# EAGLE design smile1 (EAGLE 5.05)
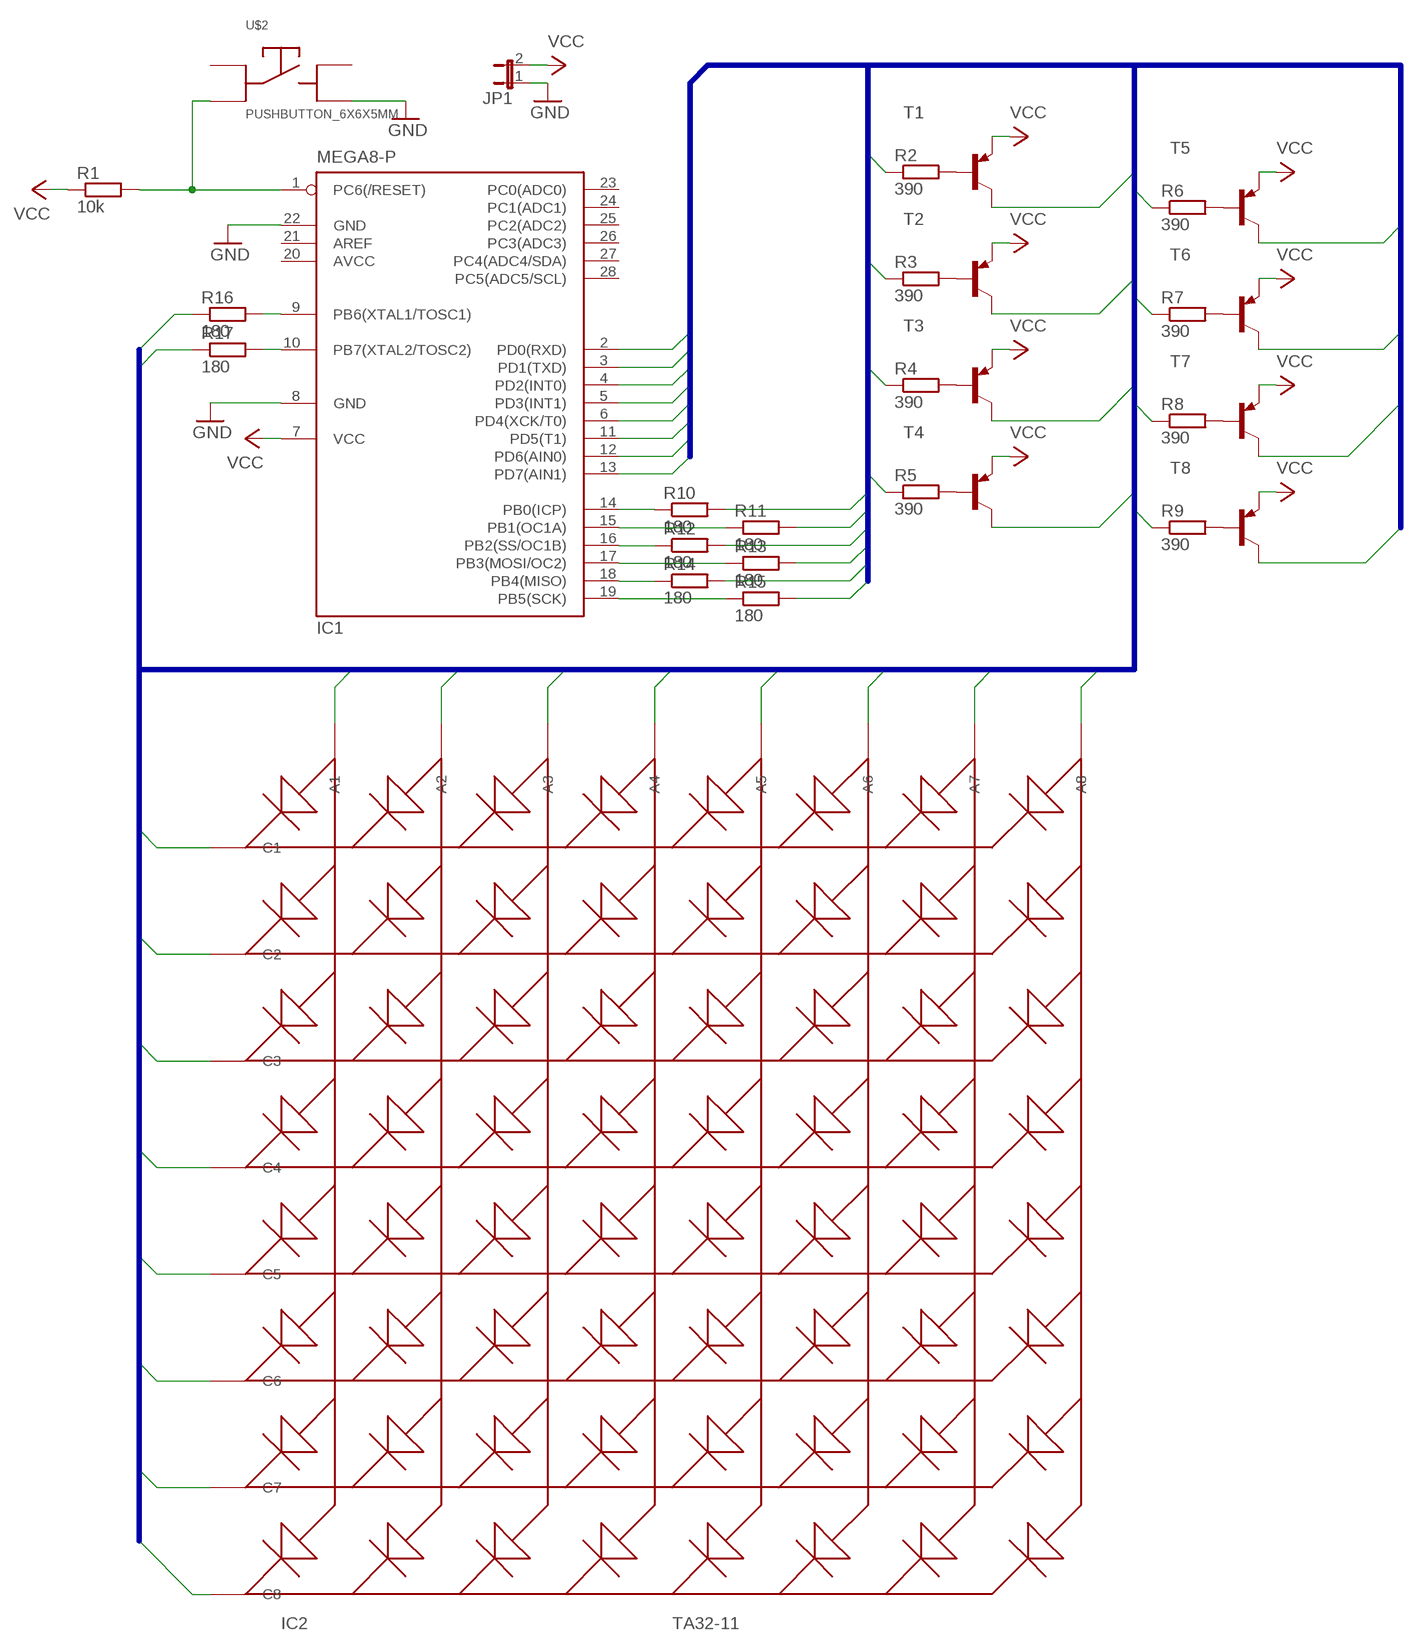
[diagram p0: schematic, sheet 1]

## Parts
IC1  MEGA8-P  [DIL28-3]
IC2  TA32-11  [TA23-11]
JP1  JP1E  [JP1]
R1  10k  R-EU_R0805  [R0805]
R2  390  R-EU_R0805  [R0805]
R3  390  R-EU_R0805  [R0805]
R4  390  R-EU_R0805  [R0805]
R5  390  R-EU_R0805  [R0805]
R6  390  R-EU_R0805  [R0805]
R7  390  R-EU_R0805  [R0805]
R8  390  R-EU_R0805  [R0805]
R9  390  R-EU_R0805  [R0805]
R10  180  R-EU_R0805  [R0805]
R11  180  R-EU_R0805  [R0805]
R12  180  R-EU_R0805  [R0805]
R13  180  R-EU_R0805  [R0805]
R14  180  R-EU_R0805  [R0805]
R15  180  R-EU_R0805  [R0805]
R16  180  R-EU_R0805  [R0805]
R17  180  R-EU_R0805  [R0805]
T1  BC807-16-PNP-SOT23-BEC  [SOT23-BEC]
T2  BC807-16-PNP-SOT23-BEC  [SOT23-BEC]
T3  BC807-16-PNP-SOT23-BEC  [SOT23-BEC]
T4  BC807-16-PNP-SOT23-BEC  [SOT23-BEC]
T5  BC807-16-PNP-SOT23-BEC  [SOT23-BEC]
T6  BC807-16-PNP-SOT23-BEC  [SOT23-BEC]
T7  BC807-16-PNP-SOT23-BEC  [SOT23-BEC]
T8  BC807-16-PNP-SOT23-BEC  [SOT23-BEC]
U$2  PUSHBUTTON_6X6X5MM  [TACT_6X6X5MM]

## Nets
A0: IC2.P$13(A1) T1.C
A1: IC2.P$3(A2) T2.C
A2: IC2.P$4(A3) T3.C
A3: IC2.P$10(A4) T4.C
A4: IC2.P$6(A5) T5.C
A5: IC2.P$11(A6) T6.C
A6: IC2.P$15(A7) T7.C
A7: IC2.P$16(A8) T8.C
C0: IC1.2(PD0(RXD)) R2.1
C1: IC1.3(PD1(TXD)) R3.1
C2: IC1.4(PD2(INT0)) R4.1
C3: IC1.5(PD3(INT1)) R5.1
C4: IC1.6(PD4(XCK/T0)) R6.1
C5: IC1.11(PD5(T1)) R7.1
C6: IC1.12(PD6(AIN0)) R8.1
C7: IC1.13(PD7(AIN1)) R9.1
GND: IC1.8(GND) IC1.22(GND) JP1.1 U$2.PIN2.2
N$1: IC1.1(PC6(/RESET)) R1.2 U$2.PIN1.2
N$2: R2.2 T1.B
N$3: R3.2 T2.B
N$4: R4.2 T3.B
N$5: R5.2 T4.B
N$6: R6.2 T5.B
N$7: R7.2 T6.B
N$8: R8.2 T7.B
N$9: R9.2 T8.B
N$10: IC1.14(PB0(ICP)) R10.1
N$11: IC1.15(PB1(OC1A)) R11.1
N$12: IC1.16(PB2(SS/OC1B)) R12.1
N$13: IC1.17(PB3(MOSI/OC2)) R13.1
N$14: IC1.18(PB4(MISO)) R14.1
N$15: IC1.19(PB5(SCK)) R15.1
N$16: IC1.9(PB6(XTAL1/TOSC1)) R16.2
N$17: IC1.10(PB7(XTAL2/TOSC2)) R17.2
R0: IC2.P$9(C1) R10.2
R1: IC2.P$14(C2) R11.2
R2: IC2.P$8(C3) R12.2
R3: IC2.P$12(C4) R13.2
R4: IC2.P$1(C5) R14.2
R5: IC2.P$7(C6) R15.2
R6: IC2.P$2(C7) R16.1
R7: IC2.P$5(C8) R17.1
VCC: IC1.7(VCC) JP1.2 R1.1 T1.E T2.E T3.E T4.E T5.E T6.E T7.E T8.E
Unconnected: IC1.21(AREF) IC1.23(PC0(ADC0)) IC1.24(PC1(ADC1)) IC1.25(PC2(ADC2)) IC1.26(PC3(ADC3)) IC1.27(PC4(ADC4/SDA)) IC1.28(PC5(ADC5/SCL)) U$2.PIN1.1 U$2.PIN2.1(PIN2,1)

## Buses
BUS1:C[0..7],PWR[0..7],R[0..7],A[0..7]

## Power pins joined to a net without a drawn wire
AVCC: IC1.20(AVCC)

## Library data of the parts
IC1 = atmel:MEGA8-P: MICROCONTROLLER 8 Kbytes FLASH, 1 kbytes SRAM, 512 bytes EEPROM, USART, 4-channel 10 bit ADC, 2-channel 8 bit ADC Pin compatible with Atmega48, ATMega88, ATMega168 Source: avr.lbr
IC2 = kingbright:TA32-11: TA23-11 Kingbright 8x8 LAD Matrix
JP1 = jumper:JP1E: JUMPER
R1-R17 = rcl:R-EU_: RESISTOR, European symbol
T1-T8 = transistor:*-PNP-: PNP Transistror
U$2 = button:PUSHBUTTON_6X6X5MM: PushButton 6x6x5mm

## Board
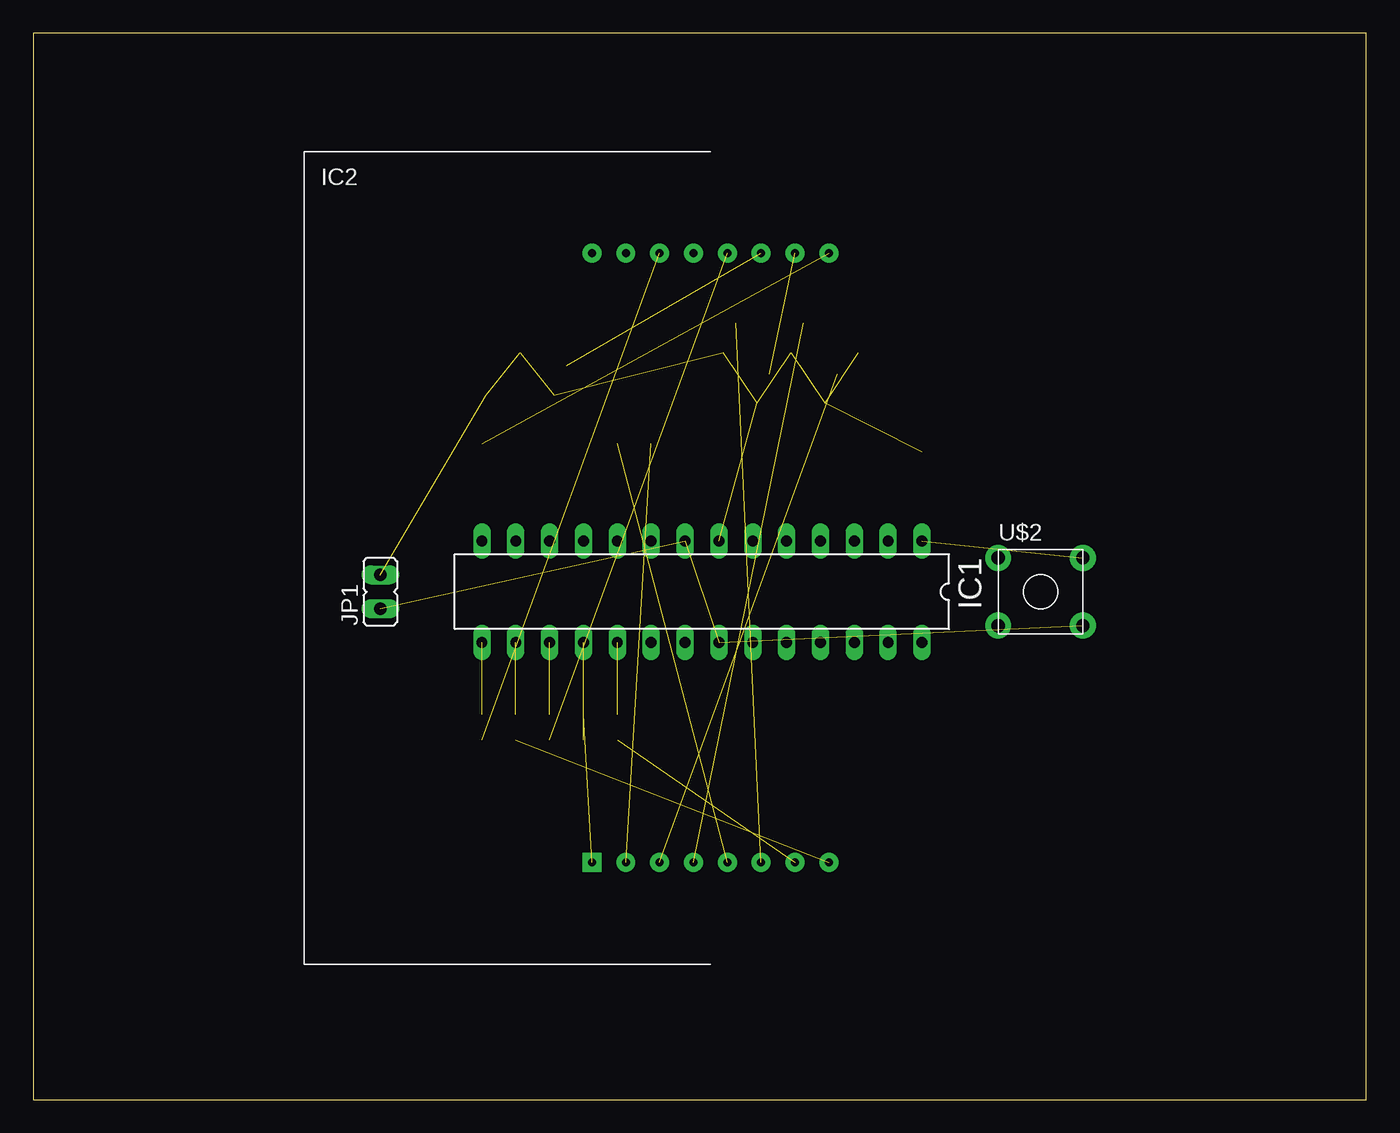
[diagram p1: board, top side]
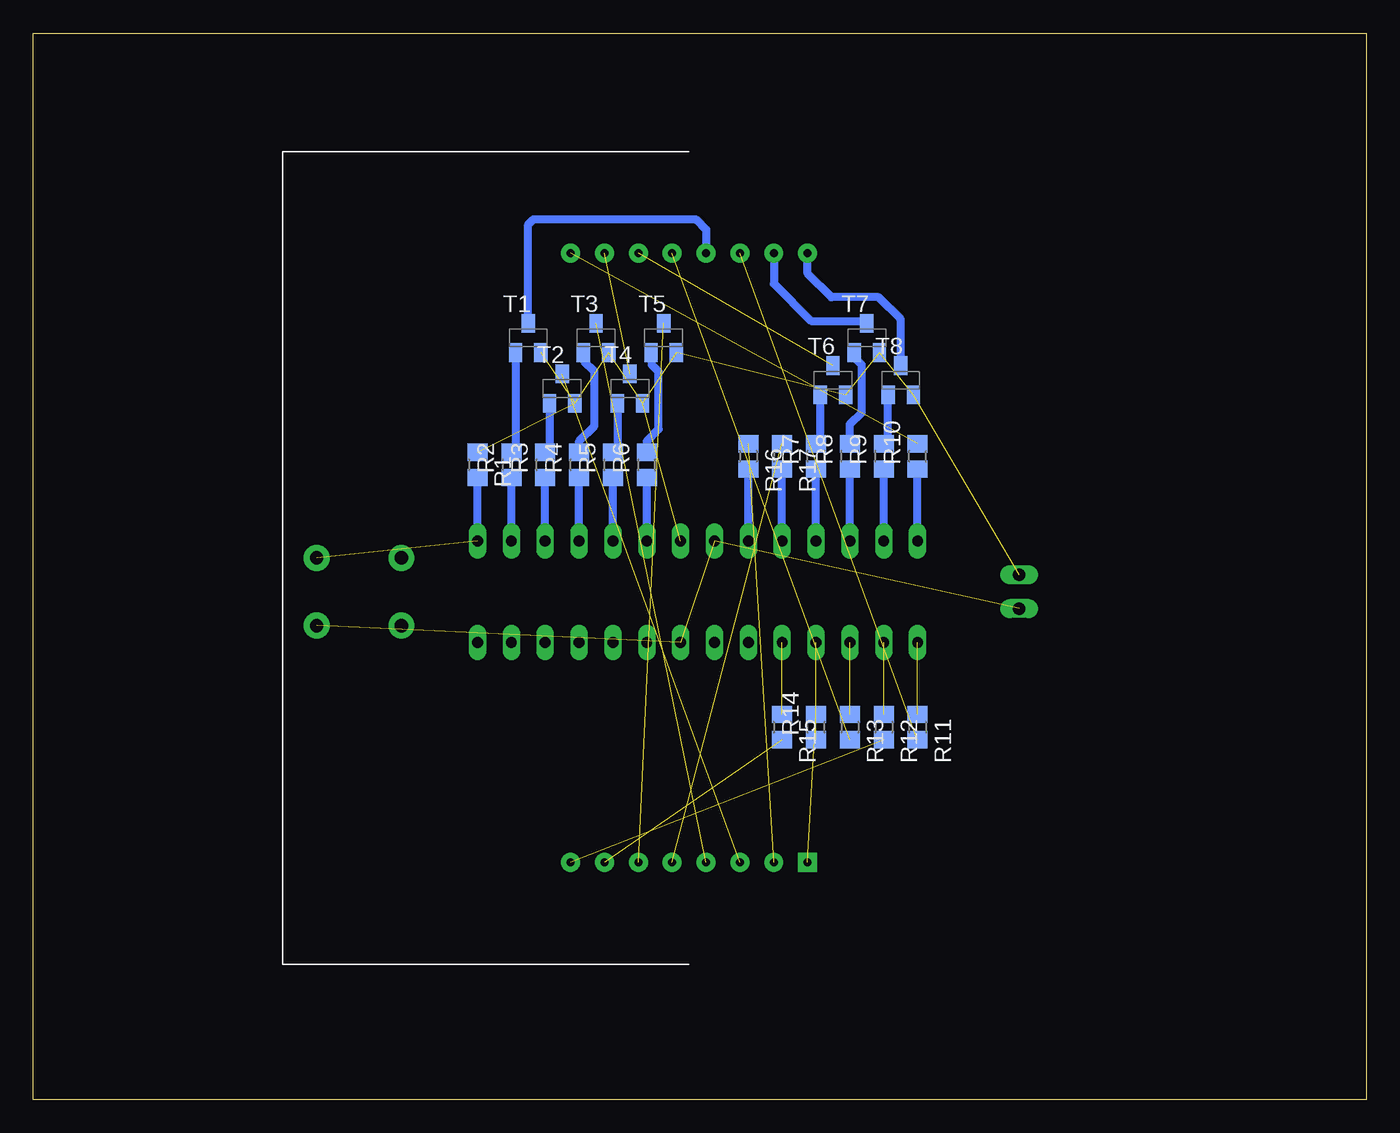
[diagram p2: board, bottom side, seen from below]

Size 100 x 80 mm. Coordinates in mm from the lower left corner, seen from the top.
Outline: 0,0 100,0 100,80 0,80 0,0
Copper layers (1*16): Top 0.035mm / dielectric 1.5mm / Bottom 0.035mm
Design rules "default": minimum track width 10mil, minimum drill 24mil, track to track 8mil, track to pad 8mil, pad to pad 8mil, via to via 8mil, smd to smd 8mil, copper to edge 40mil, drill to drill 8mil, minimum pad ring 10mil, minimum via ring 8mil, stop-mask expansion 4mil, vias tented up to drill 0mil, thermal gap 10mil

### Footprints (pad centres in the part's own frame; a part is rotated, then mirrored left to right if it is on the bottom)
DIL28-3 = drill 0.813 long: 1 -16.51,-3.81; 2 -13.97,-3.81; 3 -11.43,-3.81; 4 -8.89,-3.81; 5 -6.35,-3.81; 6 -3.81,-3.81; 7 -1.27,-3.81; 8 1.27,-3.81; 9 3.81,-3.81; 10 6.35,-3.81; 11 8.89,-3.81; 12 11.43,-3.81; 13 13.97,-3.81; 14 16.51,-3.81; 15 16.51,3.81; 16 13.97,3.81; 17 11.43,3.81; 18 8.89,3.81; 19 6.35,3.81; 20 3.81,3.81; 21 1.27,3.81; 22 -1.27,3.81; 23 -3.81,3.81; 24 -6.35,3.81; 25 -8.89,3.81; 26 -11.43,3.81; 27 -13.97,3.81; 28 -16.51,3.81
TA23-11 = drill 0.6 pad 1.422 square: P$1 0,0 | drill 0.6 pad 1.422 round: P$2 2.54,0; P$3 5.08,0; P$4 7.62,0; P$5 10.16,0; P$6 12.7,0; P$7 15.24,0; P$8 17.78,0; P$9 17.78,45.72; P$10 15.24,45.72; P$11 12.7,45.72; P$12 10.16,45.72; P$13 7.62,45.72; P$14 5.08,45.72; P$15 2.54,45.72; P$16 0,45.72
JP1 = drill 0.914 long: 1 0,-1.27; 2 0,1.27
R0805 = smd 1.3 x 1.5: 1 -0.95,0; 2 0.95,0
SOT23-BEC = smd 1 x 1.4: B -0.95,-1.1; C 0,1.1; E 0.95,-1.1
TACT_6X6X5MM = drill 1 pad 1.93 round: PIN1.1 0,0; PIN1.2 6.35,0; PIN2.1 0,-5.08; PIN2.2 6.35,-5.08

### Placement (x,y rotation side)
IC1  50.16,38.1 180 top
IC2  41.91,17.78 0 top
JP1  26.04,38.1 0 top
R1  66.67,47.62 270 bottom
R2  64.14,47.62 90 bottom
R3  61.59,47.62 90 bottom
R4  59.05,47.62 90 bottom
R5  56.52,47.62 90 bottom
R6  53.98,47.62 90 bottom
R7  41.27,48.26 90 bottom
R8  38.73,48.26 90 bottom
R9  36.2,48.26 90 bottom
R10  33.66,48.26 90 bottom
R11  33.66,27.94 270 bottom
R12  36.2,27.94 270 bottom
R13  38.73,27.94 270 bottom
R14  41.27,27.94 90 bottom
R15  43.81,27.94 270 bottom
R16  46.35,48.26 270 bottom
R17  43.81,48.26 270 bottom
T1  62.87,57.15 0 bottom
T2  60.33,53.34 0 bottom
T3  57.78,57.15 0 bottom
T4  55.24,53.34 0 bottom
T5  52.7,57.15 0 bottom
T6  40.01,53.98 0 bottom
T7  37.47,57.15 0 bottom
T8  34.92,53.98 0 bottom
U$2  72.39,40.64 0 top

### Tracks (layer width: path | path; a pad name or v marks a point on that pad's centre or on a via)
A0
  Bottom 0.61: T1.C 62.87,65.66 62.48,66.04 50.29,66.04 49.53,65.28 IC2.P$13
A1  (1 unrouted)
A2  (1 unrouted)
A3  (1 unrouted)
A4  (1 unrouted)
A5  (1 unrouted)
A6
  Bottom 0.61: IC2.P$15 44.45,61.21 41.66,58.42 37.63,58.42 T7.C
A7
  Bottom 0.61: T8.C 34.92,58.55 36.58,60.2 40.13,60.2 41.91,61.98 IC2.P$16
C0
  Bottom 0.61: IC1.2 R2.1
C1
  Bottom 0.61: IC1.3 R3.1
C2
  Bottom 0.61: IC1.4 R4.1
C3
  Bottom 0.61: IC1.5 R5.1
C4
  Bottom 0.61: IC1.6 R6.1
C5
  Bottom 0.61: IC1.11 R7.1
C6
  Bottom 0.61: IC1.12 R8.1
C7
  Bottom 0.61: IC1.13 R9.1
GND  (3 unrouted)
N$1  (1 unrouted)
  Bottom 0.61: IC1.1 R1.2
N$2
  Bottom 0.61: T1.B 63.81,48.9 R2.2
N$3
  Bottom 0.61: T2.B 61.27,48.9 R3.2
N$4
  Bottom 0.61: R4.2 59.05,49.4 57.91,50.55 57.91,54.61 58.67,55.37 58.67,55.99 T3.B
N$5
  Bottom 0.61: R5.2 56.33,48.58 56.13,48.77 56.13,52.18 T4.B
N$6
  Bottom 0.61: R6.2 53.98,49.4 53.09,50.29 53.09,54.61 53.59,55.12 53.59,55.99 T5.B
N$7
  Bottom 0.61: R7.2 40.95,49.21 T6.B
N$8
  Bottom 0.61: R8.2 38.73,50.67 37.85,51.56 37.85,55.12 38.35,55.63 38.35,55.99 T7.B
N$9
  Bottom 0.61: R9.2 35.88,49.21 T8.B
N$10
  Bottom 0.61: IC1.14 R10.1
N$11  (1 unrouted)
N$12  (1 unrouted)
N$13  (1 unrouted)
N$14  (1 unrouted)
N$15  (1 unrouted)
N$16
  Bottom 0.61: IC1.9 R16.2
N$17
  Bottom 0.61: IC1.10 R17.2
R0  (1 unrouted)
R1  (1 unrouted)
R2  (1 unrouted)
R3  (1 unrouted)
R4  (1 unrouted)
R5  (1 unrouted)
R6  (1 unrouted)
R7  (1 unrouted)
VCC  (10 unrouted)